# EAGLE design Business_Card (EAGLE 9.5.2)
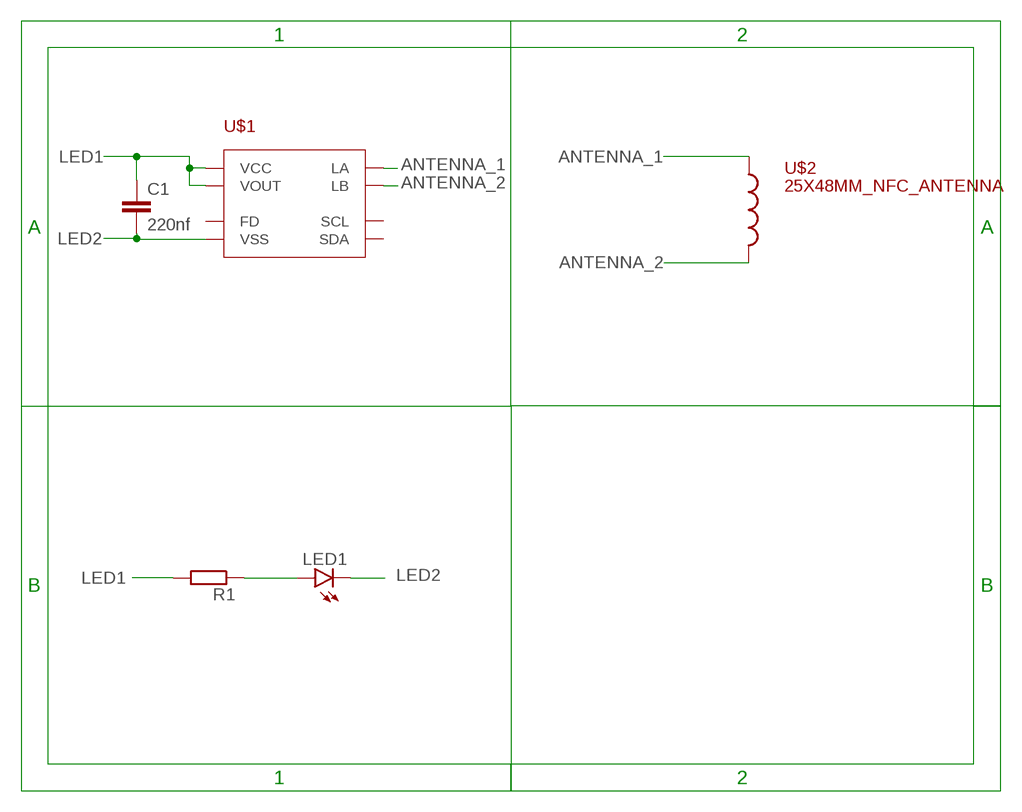
[diagram p0: schematic, sheet 1]

## Parts
C1  220nf  C-EUC0603  [C0603]
LED1  LEDCHIPLED_0805  [CHIPLED_0805]
R1  R-EU_R0603  [R0603]
U$1  NT3H  [XQFN8]
U$2  25X48MM_NFC_ANTENNA  [25X48MM_NFC_ANTENNA]

## Nets
ANTENNA_1: U$1.LA U$2.P$1
ANTENNA_2: U$1.LB U$2.P$2
LED1: C1.1 R1.2 U$1.VCC U$1.VOUT
LED2: C1.2 LED1.C U$1.VSS
N$7: LED1.A R1.1
Unconnected: U$1.FD U$1.SCL U$1.SDA

## Library data of the parts
C1 = rcl:C-EU: CAPACITOR, European symbol; SPICEPREFIX: C
LED1 = led:LED: LED OSRAM: - CHIPLED LG R971, LG N971, LY N971, LG Q971, LY Q971, LO R971, LY R971 LH N974, LH R974 LS Q976, LO Q976, LY Q976 LO Q996 - Hyper CHIPLED LW Q18S LB Q993, LB Q99A, LB R99A - SideLED LS A670, LO A670, LY A670, LG A670, LP A670 LB A673, LV A673, LT A673, LW A673 LH A674 LY A675 LS A676, LA A676, LO A676, LY A676, LW A676 LS A679, LY A679, LG A679 - Hyper Micro SIDELED® LS Y876, LA Y876, LO Y876, LY Y876 LT Y87S - SmartLED LW L88C, LW L88S LB L89C, LB L89S, LG L890 LS L89K, LO L89K, LY L89K LS L896, LA L896, LO L896, LY L896 - TOPLED LS T670, LO T670, LY T670, LG T670, LP T670 LSG T670, LSP T670, LSY T670, LOP T670, LYG T670 LG T671, LOG T671, LSG T671 LB T673, LV T673, LT T673, LW T673 LH T674 LS T676, LA T676, LO T676, LY T676, LB T676, LH T676, LSB T676, LW T676 LB T67C, LV T67C, LT T67C, LS T67K, LO T67K, LY T67K, LW E67C LS E67B, LA E67B, LO E67B, LY E67B, LB E67C, LV E67C, LT E67C LW T67C LS T679, LY T679, LG T679 LS T770, LO T770, LY T770, LG T770, LP T770 LB T773, LV T773, LT T773, LW T773 LH T774 LS E675, LA E675, LY E675, LS T675 LS T776, LA T776, LO T776, LY T776, LB T776 LHGB T686 LT T68C, LB T68C - Hyper Mini TOPLED® LB M676 - Mini TOPLED Santana® LG M470 LS M47K, LO M47K, LY M47K Source: http://www.osram.convergy.de LUXEON: - LUMILED® LXK2-PW12-R00, LXK2-PW12-S00, LXK2-PW14-U00, LXK2-PW14-V00 LXK2-PM12-R00, LXK2-PM12-S00, LXK2-PM14-U00 LXK2-PE12-Q00, LXK2-PE12-R00, LXK2-PE12-S00, LXK2-PE14-T00, LXK2-PE14-U00 LXK2-PB12-K00, LXK2-PB12-L00, LXK2-PB12-M00, LXK2-PB14-N00, LXK2-PB14-P00, LXK2-PB14-Q00 LXK2-PR12-L00, LXK2-PR12-M00, LXK2-PR14-Q00, LXK2-PR14-R00 LXK2-PD12-Q00, LXK2-PD12-R00, LXK2-PD12-S00 LXK2-PH12-R00, LXK2-PH12-S00 LXK2-PL12-P00, LXK2-PL12-Q00, LXK2-PL12-R00 Source: www.luxeon.com KINGBRIGHT: KA-3528ASYC Source: www.kingbright.com
R1 = rcl:R-EU_: RESISTOR, European symbol; SPICEPREFIX: R
U$1 = PCB_BusinessCard:NT3H: NXP NTAG NT3H
U$2 = PCB_BusinessCard:25X48MM_NFC_ANTENNA: 25x48 mm NFC loop antenna, L = 2,75 µH

## Board
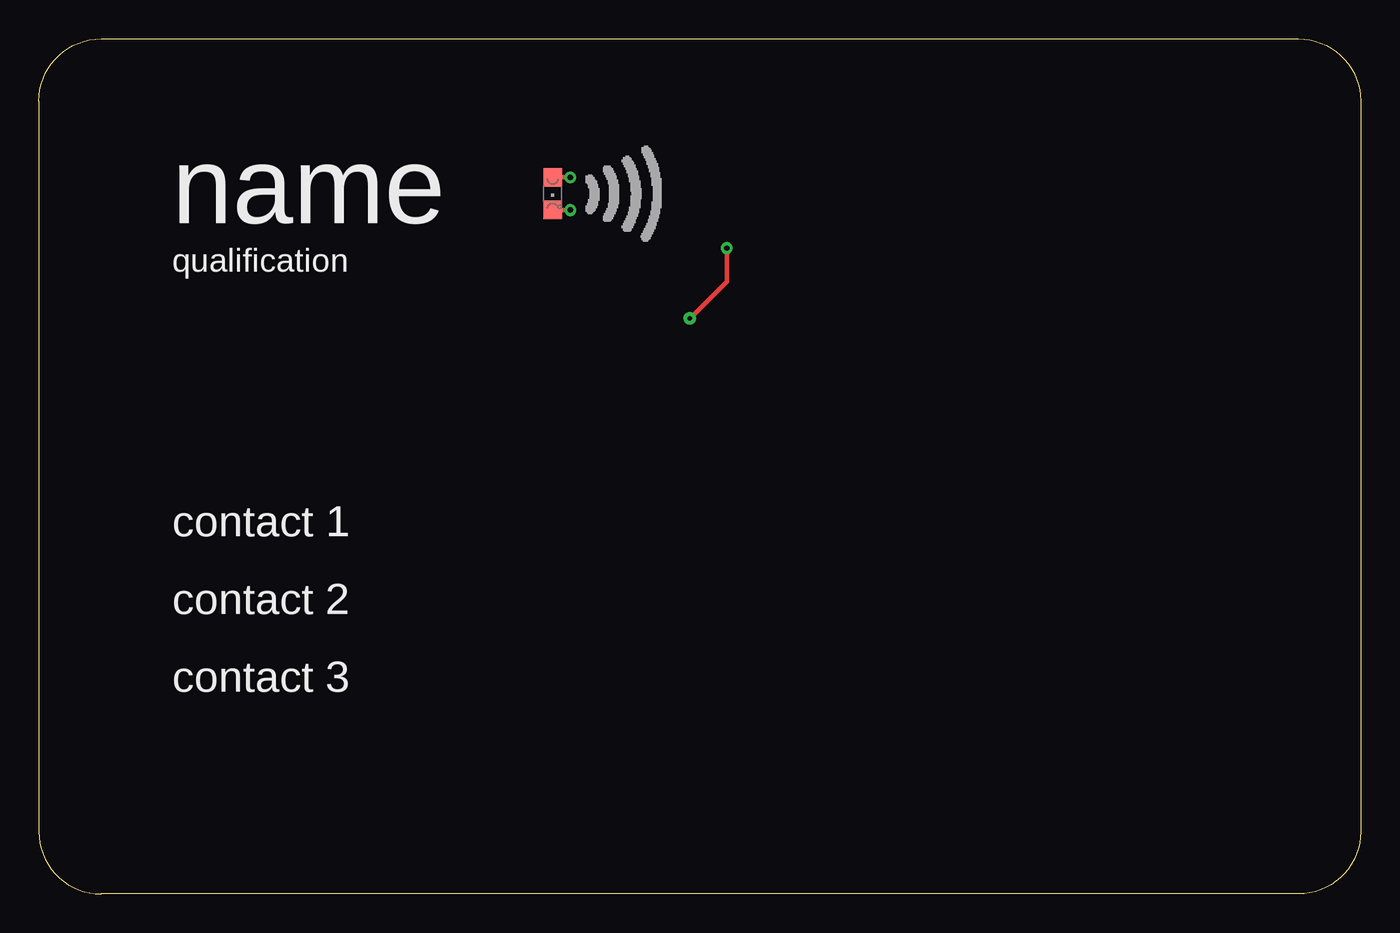
[diagram p1: board, top side]
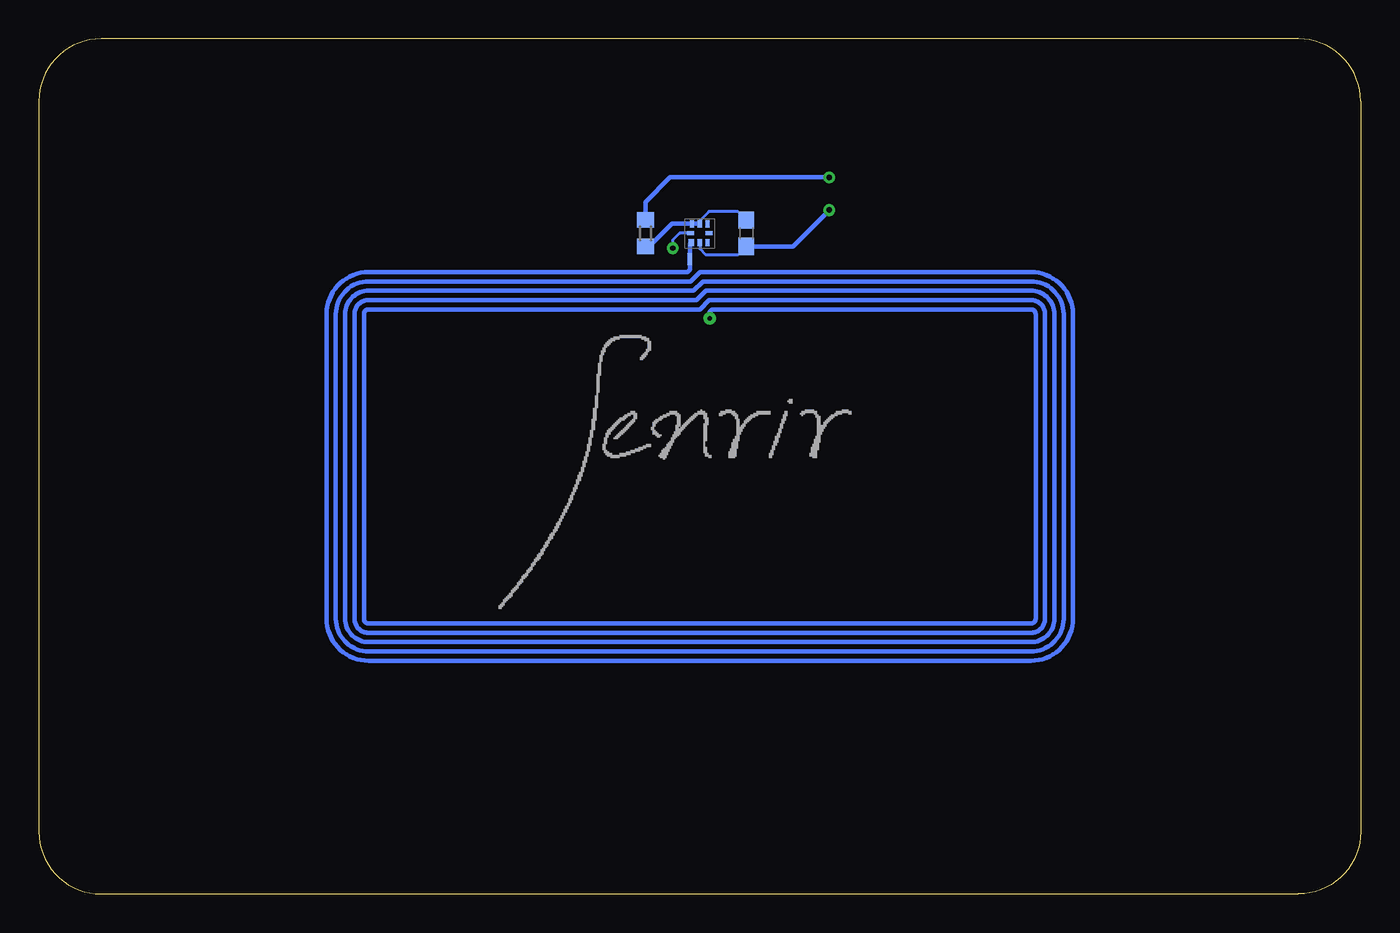
[diagram p2: board, bottom side, seen from below]

Size 85 x 55 mm. Coordinates in mm from the lower left corner, seen from the top.
Outline: 0,51 0,4 arc90 4,0 81,0 arc90 85,4 85,51 arc90 81,55 4,55 arc90 0,51
Copper layers (1*16): Top 0.035mm / dielectric 1.5mm / Bottom 0.035mm
Design rules "default *": minimum track width 0.2mm, minimum drill 0.2mm, track to track 6mil, track to pad 6mil, pad to pad 6mil, via to via 6mil, smd to smd 6mil, copper to edge 40mil, drill to drill 6mil, minimum pad ring 10mil, minimum via ring 8mil, stop-mask expansion 4mil, vias tented up to drill 0mil, thermal gap 10mil

### Footprints (pad centres in the part's own frame; a part is rotated, then mirrored left to right if it is on the bottom)
C0603 = smd 1.1 x 1: 1 -0.85,0; 2 0.85,0
CHIPLED_0805 = smd 1.2 x 1.2: A 0,-1.05; C 0,1.05
R0603 = smd 1 x 1.1: 1 -0.85,0; 2 0.85,0
XQFN8 = smd 0.27 x 0.45: FD 0,-0.6; LB 0,0.6 | smd 0.45 x 0.37: LA -0.6,0.55 | smd 0.45 x 0.27: SCL -0.6,-0.5; SDA 0.6,-0.5; VCC 0.6,0; VOUT 0.6,0.5; VSS -0.6,0
25X48MM_NFC_ANTENNA = smd 0.3 x 0.75: P$1 -0.635,13.335 | drill 0.3: P$2 0.635,9.525

### Placement (x,y rotation side)
C1  39.5,42.5 270 bottom
LED1  33.04,45.04 180 top
R1  46,42.5 270 bottom
U$1  42.5,42.5 90 bottom
U$2  42.5,27.5 0 bottom

### Tracks (layer width: path | path; a pad name or v marks a point on that pad's centre or on a via)
ANTENNA_1
  Bottom 0.3: U$1.LA 43.13,41.81 U$2.P$1
ANTENNA_2  (via drill 0.35)
  Top 0.3: v44.24,41.54 44.24,39.4 U$2.P$2
  Bottom 0.2: U$1.LB 43.8,42.5 44.24,42.06 v44.24,41.54
LED1
  Bottom 0.2: C1.1 40.05,43.9 41.92,43.9 42.5,43.32 U$1.VCC
  Bottom 0.3: U$1.VCC U$1.VOUT 44.3,43.1 45.75,41.65 R1.2
LED2  (via drill 0.35)
  Top 0.3: v34.17,43.99 LED1.C
  Bottom 0.2: U$1.VSS 42.5,41.5 42.1,41.1 40.05,41.1 C1.2
  Bottom 0.3: v34.17,43.99 36.51,41.65 C1.2 39.68,41.37
N$7  (via drill 0.35)
  Top 0.3: v34.17,46.09 LED1.A
  Bottom 0.3: 45.75,43.35 R1.1 46,44.5 44.41,46.09 v34.17,46.09

### Text on the board
tPlace: name | qualification | contact 1 | contact 2 | contact 3